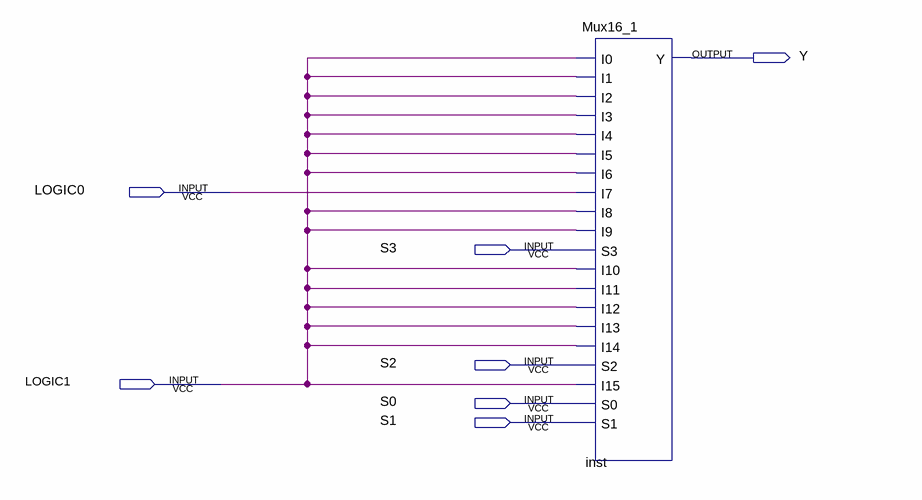
[diagram p0: schematic sheet]
// Quartus schematic MuxDemo3.bdf as structural Verilog: 1 symbols, 7 pins
module MuxDemo3 (
  input  LOGIC0,
  input  S3,
  input  S2,
  input  LOGIC1,
  input  S0,
  input  S1,
  output Y
);

  Mux16_1 inst (
    .I0(LOGIC1), .I1(LOGIC1), .I2(LOGIC1), .I3(LOGIC1), .I4(LOGIC1), .I5(LOGIC1), .I6(LOGIC1), .I7(LOGIC0),
    .I8(LOGIC1), .I9(LOGIC1), .S3(S3), .I10(LOGIC1), .I11(LOGIC1), .I12(LOGIC1), .I13(LOGIC1), .I14(LOGIC1),
    .S2(S2), .I15(LOGIC1), .S0(S0), .S1(S1), .Y(Y));
endmodule
